# Altium schematic sheet [03] - MICROCONTROLLER.SchDoc
size A4; DocumentNumber: 3; SheetNumber: 3; SheetTotal: 6
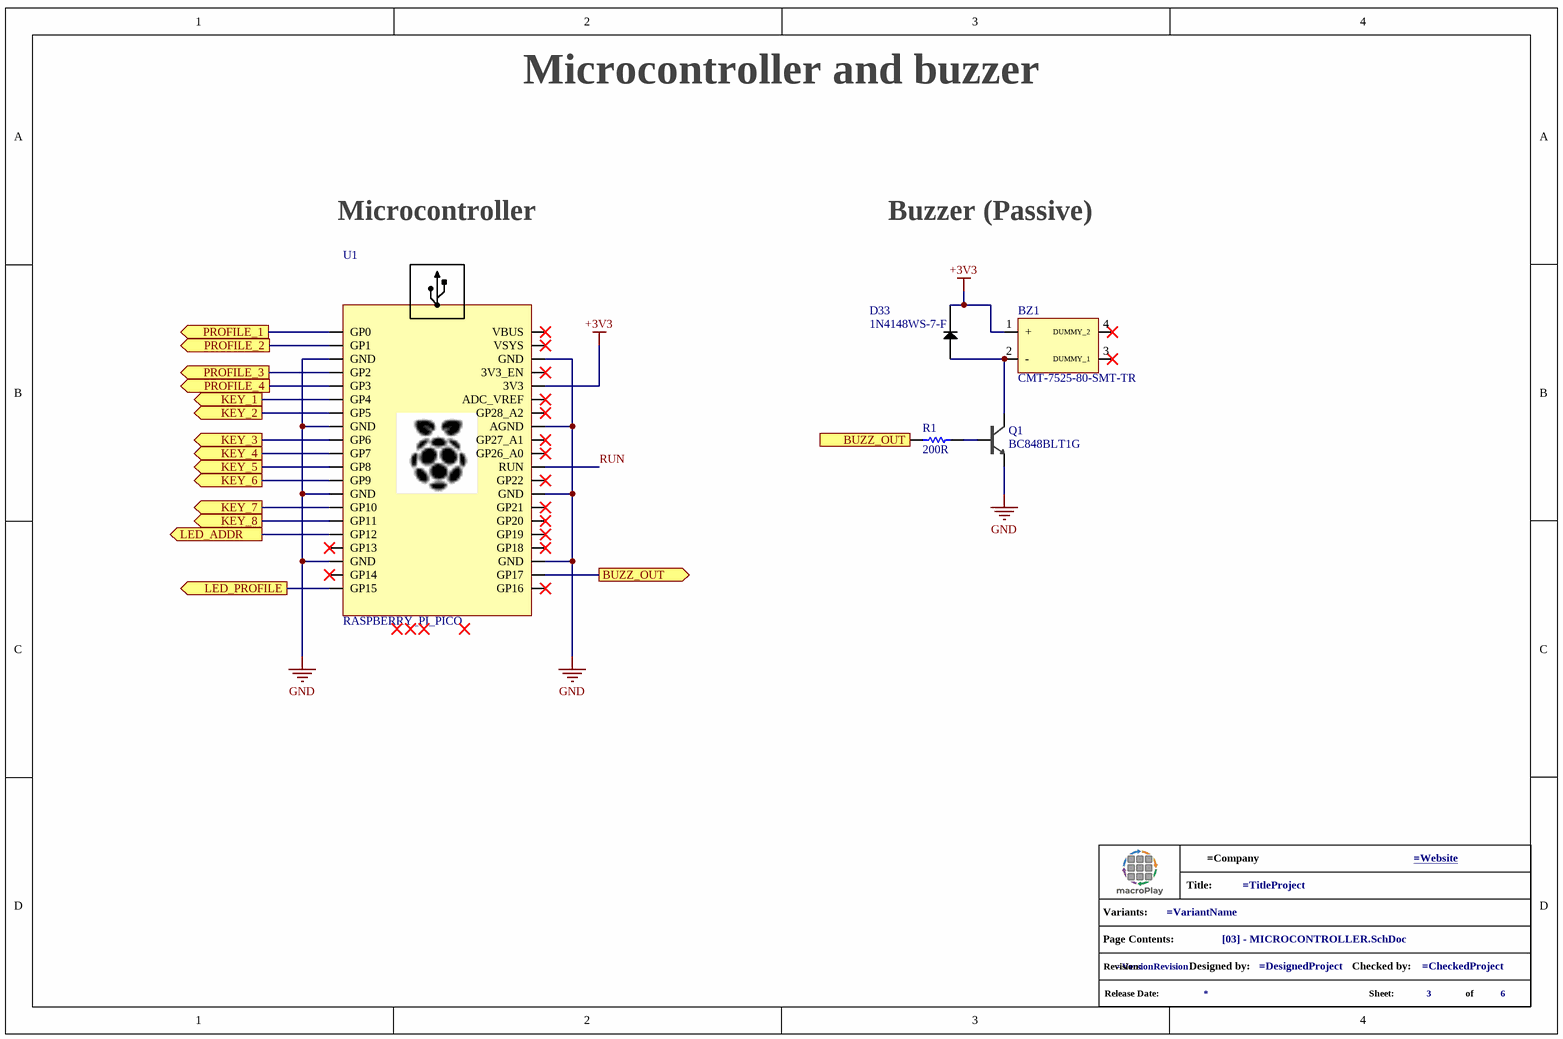
[diagram p0: [03] - MICROCONTROLLER.SchDoc]

## Parts
*?  info_project  (value not drawn)  (graphical)
BZ1  CMT-7525-80-SMT-TR  [CMT752580SMTTR]
D33  1N4148WS-7-F  [SOD2513X120N]
Q1  BC848BLT1G  [SOT-23-3]
R1  200R  [R0402 - IronSolder]
U1  RASPBERRY_PI_PICO  [RASPBERRY_PI_PICO]

## Ports
BUZZ_OUT (in), BUZZ_OUT (out), KEY_1 (out), KEY_2 (out), KEY_3 (out), KEY_4 (out), KEY_5 (out), KEY_6 (out), KEY_7 (out), KEY_8 (out), LED_ADDR (out), LED_PROFILE (out), PROFILE_1 (out), PROFILE_2 (out), PROFILE_3 (out), PROFILE_4 (out)

## Nets
+3V3: BZ1.1(+) D33.1 U1.3V3
GND: Q1.2(Emitter) U1.AGND U1.GND
BUZZ_OUT: R1.1 U1.GP17 ; port BUZZ_OUT
KEY_1: U1.GP4 ; port KEY_1
KEY_2: U1.GP5 ; port KEY_2
KEY_3: U1.GP6 ; port KEY_3
KEY_4: U1.GP7 ; port KEY_4
KEY_5: U1.GP8 ; port KEY_5
KEY_6: U1.GP9 ; port KEY_6
KEY_7: U1.GP10 ; port KEY_7
KEY_8: U1.GP11 ; port KEY_8
LED_ADDR: U1.GP12 ; port LED_ADDR
LED_PROFILE: U1.GP15 ; port LED_PROFILE
PROFILE_1: U1.GP0 ; port PROFILE_1
PROFILE_2: U1.GP1 ; port PROFILE_2
PROFILE_3: U1.GP2 ; port PROFILE_3
PROFILE_4: U1.GP3 ; port PROFILE_4
RUN: U1.RUN
NetBZ1_2: BZ1.2(-) D33.2 Q1.3(Collector)
NetQ1_1: Q1.1(Base) R1.2

Not connected (* = marked no-connect by the designer): BZ1 3(DUMMY_1)* 4(DUMMY_2)*; U1 3V3_EN* ADC_VREF* GP13* GP14* GP16* GP18* GP19* GP20* GP21* GP22* GP26_A0* GP27_A1* GP28_A2* VBUS* VSYS*

## Notes on the sheet
- Microcontroller and buzzer
- Microcontroller
- Buzzer (Passive)
- (in symbol info_project) Title:; Variants:; Page Contents:; Revision:; Designed by:; Checked by:; Release Date:; Sheet:; of

## Library data of the parts
*? = info_project: GRAPHICAL - Info Project
BZ1 = CMT-7525-80-SMT-TR: BUZZER - Buzzers Transducer, Externally Driven Magnetic 3.6 V 100mA 2.73kHz 80dB @ 3.6V, 10cm Surface Mount Solder Pads; Manufacturer_Name: Same Sky; Datasheet Link: https://www.sameskydevices.com/product/resource/CMT-7525-80-SMT-TR.pdf; Height: 2.7mm; Manufacturer_Part_Number: CMT-7525-80-SMT-TR; Mouser Part Number: 490-CMT-7525-80SMTTR; Mouser Price/Stock: https://www.mouser.co.uk/ProductDetail/Same-Sky/CMT-7525-80-SMT-TR?qs=P1JMDcb91o5izP7Xira9ww%3D%3D; Arrow Part Number: CMT-7525-80-SMT-TR; Arrow Price/Stock: https://www.arrow.com/en/products/cmt-7525-80-smt-tr/cui-devices?region=nac
D33 = 1N4148WS-7-F: DIODE - Diode 75 V 150mA Surface Mount SOD-323; Manufacturer_Name: Diodes Incorporated; Datasheet Link: https://www.diodes.com//assets/Datasheets/1N4148WS_BAV16WS.pdf; Height: 1.2mm; Manufacturer_Part_Number: 1N4148WS-7-F; Mouser Part Number: 621-1N4148WS-F; Mouser Price/Stock: https://www.mouser.co.uk/ProductDetail/Diodes-Incorporated/1N4148WS-7-F?qs=4drIV0IxA0r8aNy7%2Fu4kVw%3D%3D; Arrow Part Number: 1N4148WS-7-F; Arrow Price/Stock: https://www.arrow.com/en/products/1n4148ws-7-f/diodes-incorporated?utm_currency=USD&region=europe
Q1 = BC848BLT1G: TRANS - NPN 30V 100mA 300mW SOT23-3.; Manufacturer 1: ON Semiconductor; Emitter Base Voltage (VEBO): 5V; Collector Emitter Saturation Voltage: 600mV; Transition Frequency: 100MHz; hFE Min: 200; Number of Elements: 1; Description 1: NPN Ic=100mA Vceo=30V hfe=200~450 P=225mW SOT-23; Category 1: BJTs; .Mounting: SMT; .PCBChecked: Lucas Vieira; Case/Package: SOT-23-3; Pins: 3; Contact Plating: Tin,Matte; Min Operating Temperature: -55°C; Max Operating Temperature: 150°C; Packaging: Tape and Reel; Polarity: NPN; Collector Emitter Breakdown Voltage: 30V; Max Power Dissipation: 300mW; Package Quantity: 3000; Collector Base Voltage (VCBO): 30V; Max Collector Current: 100mA; Max Breakdown Voltage: 30V; Power Dissipation: 300mW; Clock Frequency: 100MHz; Voltage Rating (DC): 30V; Current Rating: 100mA; Collector-emitter Voltage-Max: 600mV; Series: -; Collector Emitter Voltage (VCEO): 30V; Frequency: 100MHz; Gain Bandwidth Product: 100MHz; Length: 2.9mm; Width: 1.3mm; Height: 0.94mm; Radiation Hardening: No; Lead Free: Lead Free; Reach SVHC Compliant: No; RoHS Compliant: Yes; ComponentLink1URL: https://datasheet.ciiva.com/15139/getdatasheetpartid-87781-15139134.pdf?src-supplier=Verical; ComponentLink1Description: https://datasheet.ciiva.com/15139/getdatasheetpartid-87781-15139134.pdf?src-supplier=Verical; ComponentLink2URL: https://datasheet.ciiva.com/7971/bc846alt1-d-7971962.pdf?src-supplier=Element14; ComponentLink2Description: https://datasheet.ciiva.com/7971/bc846alt1-d-7971962.pdf?src-supplier=Element14; ComponentLink3URL: https://datasheet.ciiva.com/7971/bc846alt1-d-7971960.pdf?src-supplier=Element14; ComponentLink3Description: https://datasheet.ciiva.com/7971/bc846alt1-d-7971960.pdf?src-supplier=Element14; ComponentLink4URL: https://datasheet.ciiva.com/11204/bc846alt1-d-11204358.pdf?src-supplier=Avnet; ComponentLink4Description: https://datasheet.ciiva.com/11204/bc846alt1-d-11204358.pdf?src-supplier=Avnet; ComponentLink5URL: https://datasheet.ciiva.com/11198/bc846alt1-d-11198026.pdf?src-supplier=Avnet; ComponentLink5Description: https://datasheet.ciiva.com/11198/bc846alt1-d-11198026.pdf?src-supplier=Avnet; ComponentLink6URL: https://datasheet.ciiva.com/976/bc846alt1-d-976387.pdf?src-supplier=Digi-Key; ComponentLink6Description: https://datasheet.ciiva.com/976/bc846alt1-d-976387.pdf?src-supplier=Digi-Key; ComponentLink7URL: https://datasheet.ciiva.com/976/bc846alt1-d-976388.pdf?src-supplier=Digi-Key; ComponentLink7Description: https://datasheet.ciiva.com/976/bc846alt1-d-976388.pdf?src-supplier=Digi-Key; ComponentLink8URL: https://datasheet.ciiva.com/976/bc846alt1-d-976386.pdf?src-supplier=Digi-Key; ComponentLink8Description: https://datasheet.ciiva.com/976/bc846alt1-d-976386.pdf?src-supplier=Digi-Key; Supplier 1: Digi-Key; Supplier Part Number 1: BC848BLT1GOSCT-ND; Manufacturer Part Number 1: BC848BLT1G; RoHS 1: Yes; Stock 1: 199953; Pricing 1: 1=0,14, 10=0,131, 100=0,0712, 500=0,04384, 1000=0,02989 (USD); Manufacturer 2: ON Semiconductor; Manufacturer Part Number 2: SBC848BLT1G; Manufacturer 3: Nexperia USA Inc.; Manufacturer Part Number 3: BC848B,215; .SCHChecked: Lucas Vieira
R1 = RT0402BRD07200RL: RES - 200R  0.0625W 0402 0.1%  50V Fixed Resistor, Thin Film; Manufacturer 1: Yageo; Additional Feature: HIGH PRECISION; Power: 62.5mW; Rated Temperature: 70°C; Temperature Coefficient (ppm/Cel): 25; Package Height: 0.3mm; Package Length: 1mm; Package Width: 0.5mm; .Mounting: SMT; Supplier: Avnet; Supplier Part Number: 49AK4062; RoHS: Yes; Category: Chip SMD Resistors; Stock: 8493; Pricing: 1=0,198, 25=0,135, 100=0,098, 250=0,087, 500=0,077 (USD); Mounting Technology: Surface Mount; Pins: 2; Case/Package: 0402; Min Operating Temperature: -55°C; Max Operating Temperature: 155°C; Tolerance: 0.1%; Resistor Type: FIXED RESISTOR; Construction: Chip; Packaging: Tape and Reel; Value: 200R; Technology: THIN FILM; Termination: Wraparound; Working Voltage: 50V; Reach SVHC Compliant: Yes; RoHS Compliant: Yes; ComponentLink1URL: https://datasheet.ciiva.com:443/pdfs/VipMasterIC/IC/YAGO/YAGO-S-A0008510989/YAGO-S-A0008510989-1.pdf?src-supplier=IHS+Markit; ComponentLink1Description: https://datasheet.ciiva.com:443/pdfs/VipMasterIC/IC/YAGO/YAGO-S-A0008510989/YAGO-S-A0008510989-1.pdf?src-supplier=IHS+Markit; ComponentLink2URL: https://datasheet.ciiva.com/12705/pyu-rt-1-to-0-05-rohs-l-4-12705967.pdf?src-supplier=Mouser; ComponentLink2Description: https://datasheet.ciiva.com/12705/pyu-rt-1-to-0-05-rohs-l-4-12705967.pdf?src-supplier=Mouser; ComponentLink3URL: https://datasheet.ciiva.com/46635/pyu-rt-1-to-0-05-rohs-l-5-46635174.pdf?src-supplier=Digikey; ComponentLink3Description: https://datasheet.ciiva.com/46635/pyu-rt-1-to-0-05-rohs-l-5-46635174.pdf?src-supplier=Digikey; ComponentLink4URL: https://datasheet.ciiva.com/2582/pyu-rt-1-to-0-05-rohs-l-4-2582220.pdf?src-supplier=Digikey; ComponentLink4Description: https://datasheet.ciiva.com/2582/pyu-rt-1-to-0-05-rohs-l-4-2582220.pdf?src-supplier=Digikey; .SCHChecked: *; .PCBChecked: *; Manufacturer Part Number 1: RT0402BRD07200RL
U1 = RASPBERRY_PI_PICO: MCU Module - Raspberry Pi Board, Arm Cortex-M0+; Core Architecture:Arm; Core Sub-Architecture:Cortex-M0+; Kit Contents:Raspberry Pi Pico Board; No. Of Bits:32Bit; Silicon Core Number:Rp2040; Silicon Manufacturer:Raspberry Pi |Raspberry-Pi RASPBERRY PI PICO; .Mounting: SMD or PTH variant; SnapEDA_Link: https://www.snapeda.com/parts/RASPBERRY%20PI%20PICO/Raspberry+Pi/view-part/?ref=snap; Package: None; Value: *; MF: Raspberry Pi; MP: RASPBERRY PI PICO; Check_prices: https://www.snapeda.com/parts/RASPBERRY%20PI%20PICO/Raspberry+Pi/view-part/?ref=eda; .PCBChecked: *; .SCHChecked: *